# EAGLE design boo (EAGLE 8.3.2)
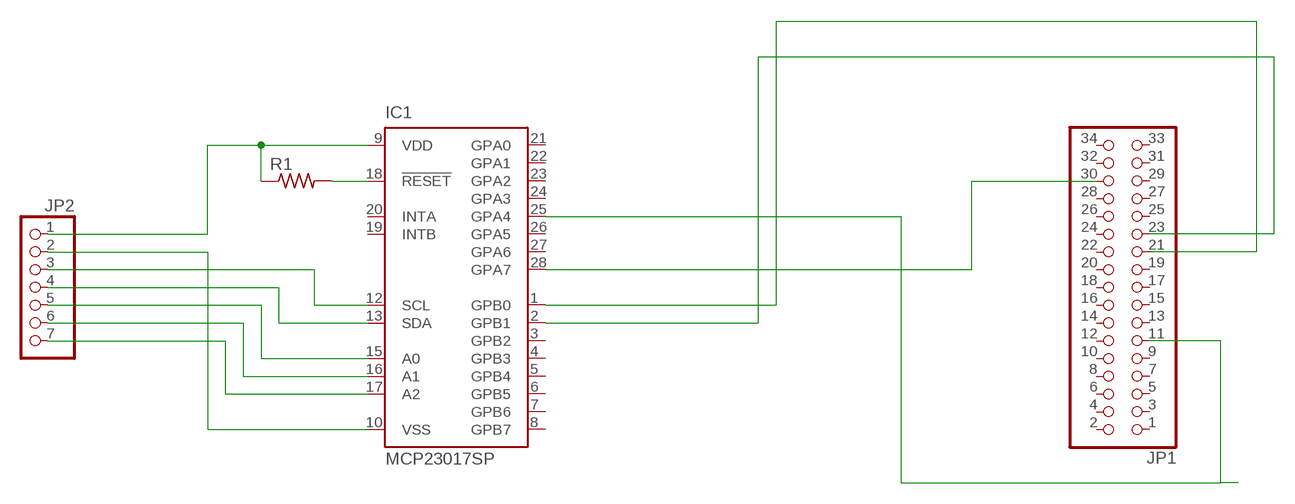
[diagram p0: schematic, sheet 1]

## Parts
IC1  MCP23017SP  [DIL28-3]
JP1  PINHD-2X17  [2X17]
JP2  PINHD-1X7  [1X07]
R1  R-US_0207/10  [0207/10]

## Nets
N$1: IC1.1(GPB0) JP1.21
N$2: IC1.2(GPB1) JP1.23
N$3: IC1.9(VDD) JP2.1 R1.1
N$4: IC1.10(VSS) JP2.2
N$5: IC1.12(SCL) JP2.3
N$6: IC1.13(SDA) JP2.4
N$7: IC1.15(A0) JP2.5
N$8: JP2.6
N$9: IC1.17(A2) JP2.7
N$10: IC1.18(!RESET) R1.2
N$11: IC1.28(GPA7) JP1.30
N$12: IC1.25(GPA4) JP1.11
Unconnected: IC1.3(GPB2) IC1.4(GPB3) IC1.5(GPB4) IC1.6(GPB5) IC1.7(GPB6) IC1.8(GPB7) IC1.16(A1) IC1.19(INTB) IC1.20(INTA) IC1.21(GPA0) IC1.22(GPA1) IC1.23(GPA2) IC1.24(GPA3) IC1.26(GPA5) IC1.27(GPA6) JP1.1 JP1.2 JP1.3 JP1.4 JP1.5 JP1.6 JP1.7 JP1.8 JP1.9 JP1.10 JP1.12 JP1.13 JP1.14 JP1.15 JP1.16 JP1.17 JP1.18 JP1.19 JP1.20 JP1.22 JP1.24 JP1.25 JP1.26 JP1.27 JP1.28 JP1.29 JP1.31 JP1.32 JP1.33 JP1.34

## Library data of the parts
IC1 = microchip:MCP23017: http://ww1.microchip.com/downloads/en/DeviceDoc/21952a.pdf Source: http://ww1.microchip.com/downloads/en/DeviceDoc/21952a.pdf; MF: MICROCHIP; MPN: MCP23017-E/SP; OC_FARNELL: 1332088; OC_NEWARK: 31K2959
JP1 = pinhead:PINHD-2X17: PIN HEADER
JP2 = pinhead:PINHD-1X7: PIN HEADER
R1 = resistor:R-US_: RESISTOR, American symbol

## Board
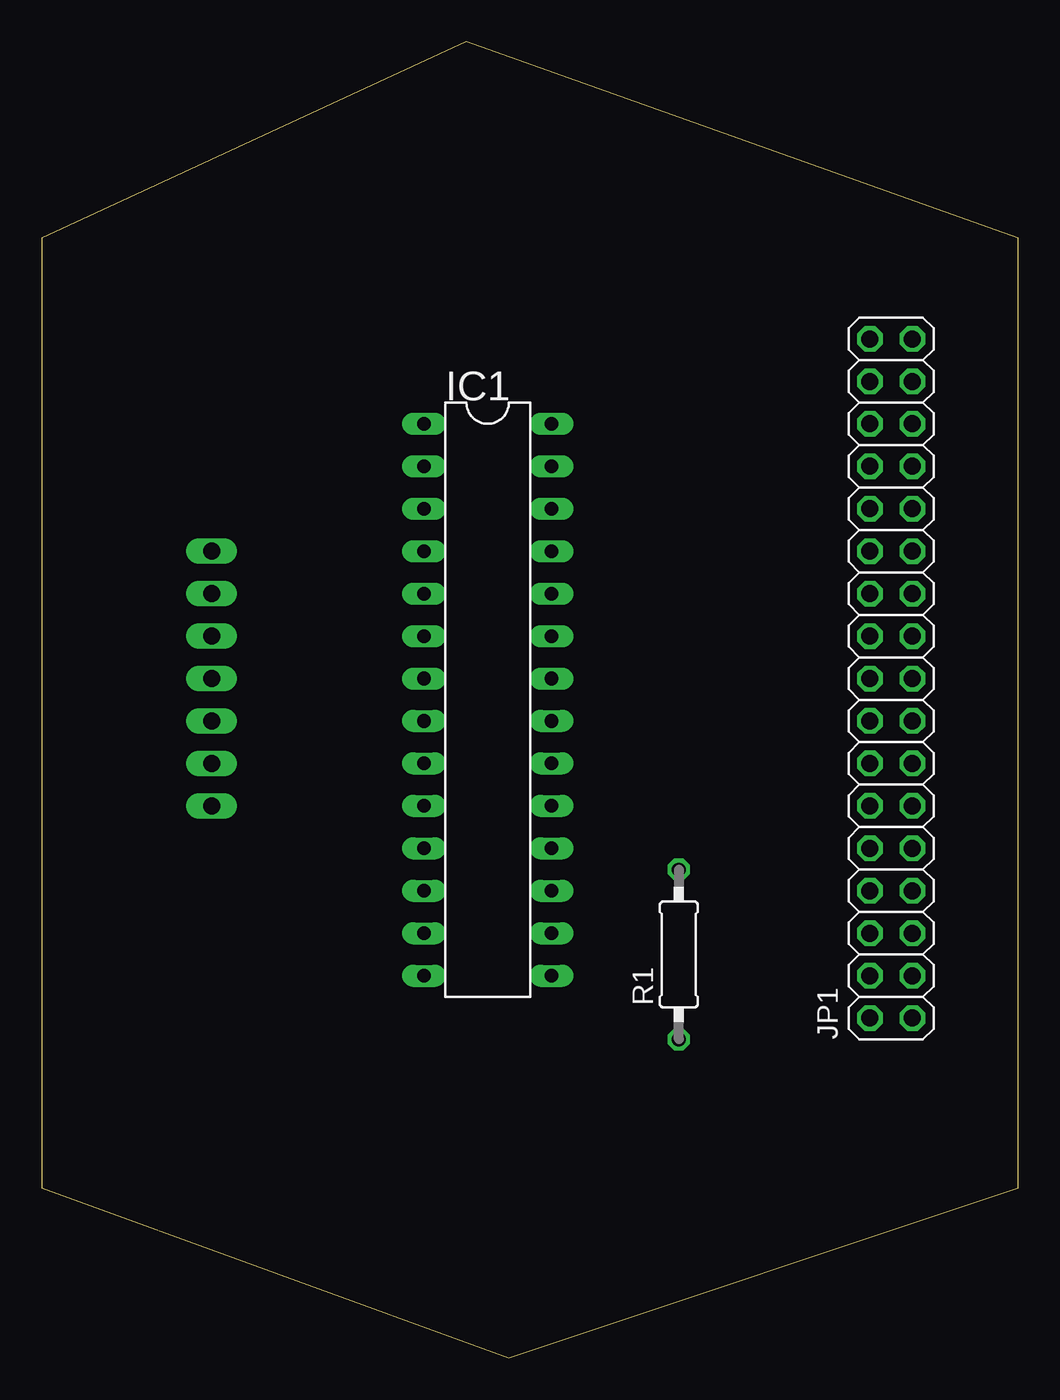
[diagram p1: board, top side]
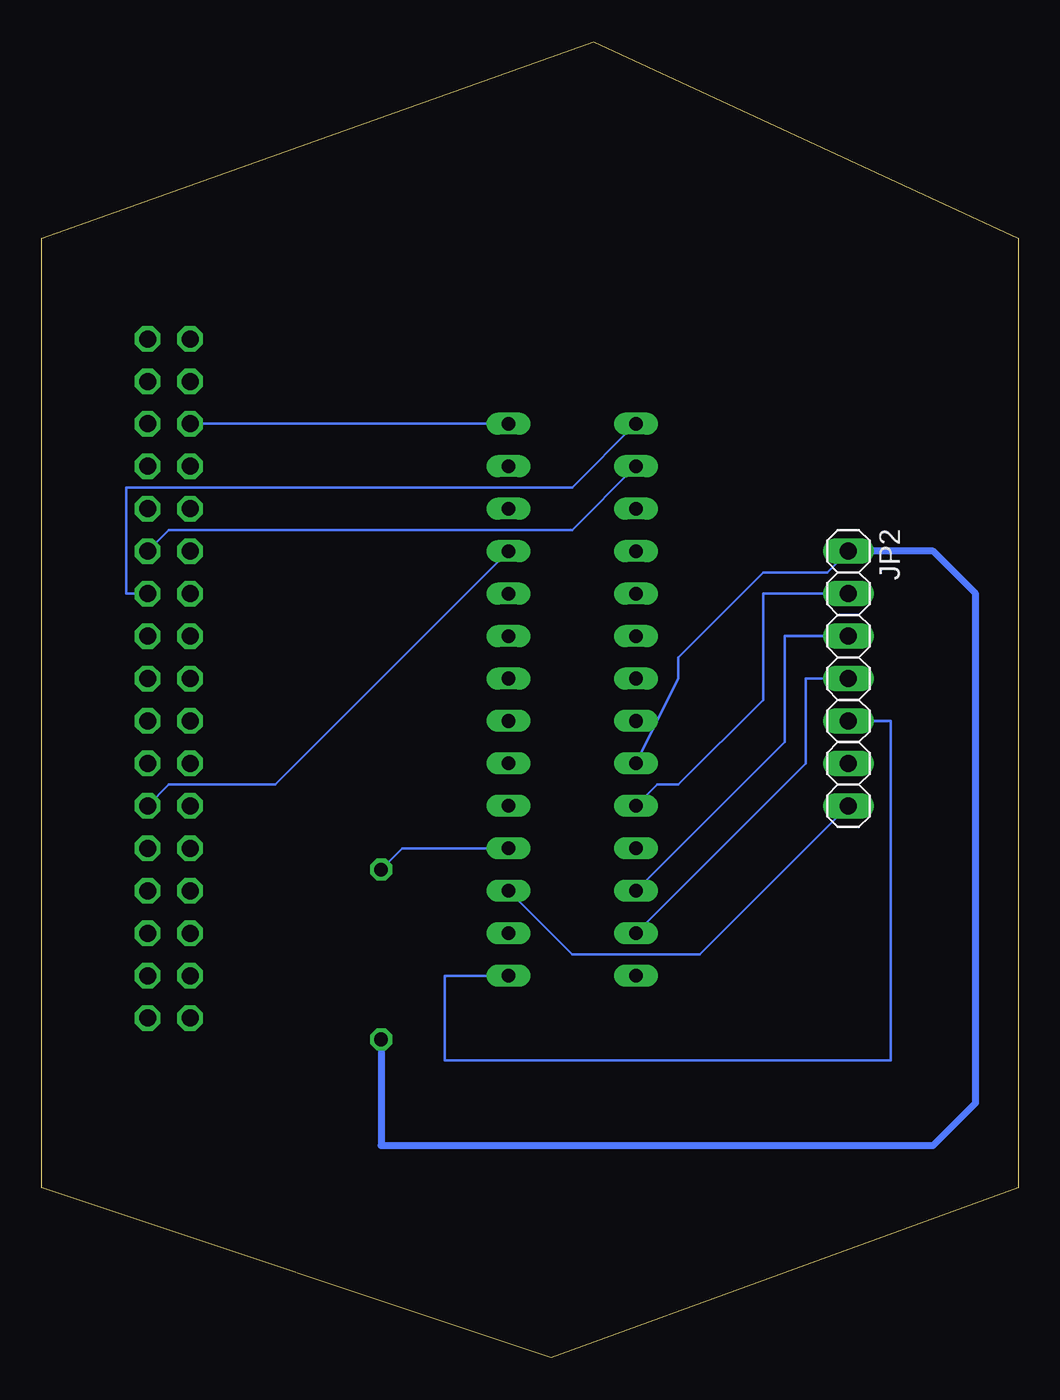
[diagram p2: board, bottom side, seen from below]

Size 58.4 x 78.74 mm. Coordinates in mm from the lower left corner, seen from the top.
Outline: 0,10.16 27.94,0 58.4,10.16 58.4,66.98 25.4,78.74 0,66.98 0,10.16
Copper layers (1*16): Top 0.035mm / dielectric 1.5mm / Bottom 0.035mm
Design rules "default": minimum track width 6mil, minimum drill 0.35mm, track to track 6mil, track to pad 6mil, pad to pad 6mil, via to via 6mil, smd to smd 6mil, copper to edge 40mil, drill to drill 6mil, minimum pad ring 10mil, minimum via ring 8mil, stop-mask expansion 4mil, vias tented up to drill 0mil, thermal gap 10mil

### Footprints (pad centres in the part's own frame; a part is rotated, then mirrored left to right if it is on the bottom)
DIL28-3 = drill 0.813 long: 1 -16.51,-3.81; 2 -13.97,-3.81; 3 -11.43,-3.81; 4 -8.89,-3.81; 5 -6.35,-3.81; 6 -3.81,-3.81; 7 -1.27,-3.81; 8 1.27,-3.81; 9 3.81,-3.81; 10 6.35,-3.81; 11 8.89,-3.81; 12 11.43,-3.81; 13 13.97,-3.81; 14 16.51,-3.81; 15 16.51,3.81; 16 13.97,3.81; 17 11.43,3.81; 18 8.89,3.81; 19 6.35,3.81; 20 3.81,3.81; 21 1.27,3.81; 22 -1.27,3.81; 23 -3.81,3.81; 24 -6.35,3.81; 25 -8.89,3.81; 26 -11.43,3.81; 27 -13.97,3.81; 28 -16.51,3.81
2X17 = drill 1.016 octagon: 1 -20.32,-1.27; 2 -20.32,1.27; 3 -17.78,-1.27; 4 -17.78,1.27; 5 -15.24,-1.27; 6 -15.24,1.27; 7 -12.7,-1.27; 8 -12.7,1.27; 9 -10.16,-1.27; 10 -10.16,1.27; 11 -7.62,-1.27; 12 -7.62,1.27; 13 -5.08,-1.27; 14 -5.08,1.27; 15 -2.54,-1.27; 16 -2.54,1.27; 17 0,-1.27; 18 0,1.27; 19 2.54,-1.27; 20 2.54,1.27; 21 5.08,-1.27; 22 5.08,1.27; 23 7.62,-1.27; 24 7.62,1.27; 25 10.16,-1.27; 26 10.16,1.27; 27 12.7,-1.27; 28 12.7,1.27; 29 15.24,-1.27; 30 15.24,1.27; 31 17.78,-1.27; 32 17.78,1.27; 33 20.32,-1.27; 34 20.32,1.27
1X07 = drill 1.016 long: 1 -7.62,0; 2 -5.08,0; 3 -2.54,0; 4 0,0; 5 2.54,0; 6 5.08,0; 7 7.62,0
0207/10 = drill 0.813 octagon: 1 -5.08,0; 2 5.08,0

### Placement (x,y rotation side)
IC1  26.67,39.37 270 top
JP1  50.8,40.64 90 top
JP2  10.16,40.64 270 bottom
R1  38.1,24.13 90 top

### Tracks (layer width: path | path; a pad name or v marks a point on that pad's centre or on a via)
N$1
  Bottom 0.152: IC1.1 26.67,52.07 53.34,52.07 53.34,45.72 JP1.21
N$2
  Bottom 0.152: IC1.2 26.67,49.53 50.8,49.53 JP1.23
N$3
  Bottom 0.152: JP2.1 11.43,46.99 15.24,46.99 20.32,41.91 20.32,40.64 IC1.9
  Bottom 0.406: R1.1 38.1,12.7 5.08,12.7 2.54,15.24 2.54,45.72 5.08,48.26 JP2.1
N$4
  Bottom 0.152: IC1.10 21.59,34.29 20.32,34.29 15.24,39.37 15.24,45.72 JP2.2
N$5
  Bottom 0.152: IC1.12 13.97,36.83 13.97,43.18 JP2.3
N$6
  Bottom 0.152: IC1.13 12.7,35.56 12.7,40.64 JP2.4
N$7
  Bottom 0.152: IC1.15 34.29,22.86 34.29,17.78 7.62,17.78 7.62,38.1 JP2.5
N$9
  Bottom 0.152: IC1.17 26.67,24.13 19.05,24.13 JP2.7
N$10
  Bottom 0.152: IC1.18 36.83,30.48 R1.2
N$11
  Bottom 0.152: JP1.30 IC1.28
N$12
  Bottom 0.152: IC1.25 44.45,34.29 50.8,34.29 JP1.11